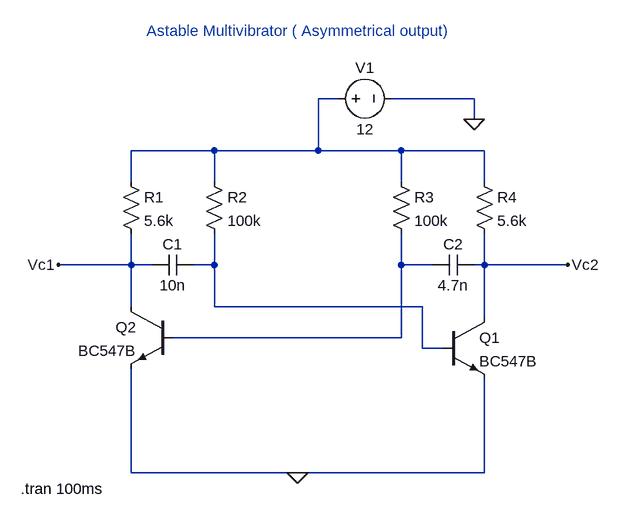
[diagram p0: schematic am2.asc]
am2.asc, the LTspice schematic file:
Version 4
SHEET 1 880 680
WIRE 400 -144 368 -144
WIRE 608 -144 480 -144
WIRE 608 -112 608 -144
WIRE 208 -64 80 -64
WIRE 368 -64 368 -144
WIRE 368 -64 208 -64
WIRE 496 -64 368 -64
WIRE 624 -64 496 -64
WIRE 80 -16 80 -64
WIRE 208 -16 208 -64
WIRE 496 -16 496 -64
WIRE 624 -16 624 -64
WIRE 80 112 80 64
WIRE 80 112 -32 112
WIRE 112 112 80 112
WIRE 208 112 208 64
WIRE 208 112 176 112
WIRE 496 112 496 64
WIRE 544 112 496 112
WIRE 624 112 624 64
WIRE 624 112 608 112
WIRE 752 112 624 112
WIRE 80 176 80 112
WIRE 208 176 208 112
WIRE 528 176 208 176
WIRE 624 192 624 112
WIRE 496 224 496 112
WIRE 496 224 144 224
WIRE 528 240 528 176
WIRE 560 240 528 240
WIRE 80 432 80 272
WIRE 336 432 80 432
WIRE 624 432 624 288
WIRE 624 432 336 432
FLAG 336 432 0
FLAG -32 112 Vc1
FLAG 752 112 Vc2
FLAG 608 -112 0
SYMBOL res 64 -32 R0
SYMATTR InstName R1
SYMATTR Value 5.6k
SYMBOL res 192 -32 R0
SYMATTR InstName R2
SYMATTR Value 100k
SYMBOL res 480 -32 R0
SYMATTR InstName R3
SYMATTR Value 100k
SYMBOL cap 176 96 R90
WINDOW 0 0 32 VBottom 2
WINDOW 3 32 32 VTop 2
SYMATTR InstName C1
SYMATTR Value 10n
SYMBOL res 608 -32 R0
SYMATTR InstName R4
SYMATTR Value 5.6k
SYMBOL cap 608 96 R90
WINDOW 0 0 32 VBottom 2
WINDOW 3 32 32 VTop 2
SYMATTR InstName C2
SYMATTR Value 4.7n
SYMBOL npn 560 192 R0
SYMATTR InstName Q1
SYMATTR Value BC547B
SYMBOL npn 144 176 M0
SYMATTR InstName Q2
SYMATTR Value BC547B
SYMBOL voltage 384 -144 R270
WINDOW 0 32 56 VTop 2
WINDOW 3 -32 56 VBottom 2
WINDOW 123 0 0 Left 0
WINDOW 39 0 0 Left 0
SYMATTR InstName V1
SYMATTR Value 12
TEXT -90 456 Left 2 !.tran 100ms
TEXT 104 -248 Left 2 ;Astable Multivibrator ( Asymmetrical output)

The netlist it stands for:
* am2.asc
R1 N001 Vc1 5.6k
R2 N001 N002 100k
R3 N001 N003 100k
C1 N002 Vc1 10n
R4 N001 Vc2 5.6k
C2 Vc2 N003 4.7n
Q1 Vc2 N002 0 0 BC547B
Q2 Vc1 N003 0 0 BC547B
V1 N001 0 12
.model NPN NPN
.model PNP PNP
.lib standard.bjt
.tran 100ms
* Astable Multivibrator ( Asymmetrical output)
.backanno
.end